# Altium schematic sheet Power.SchDoc
size A
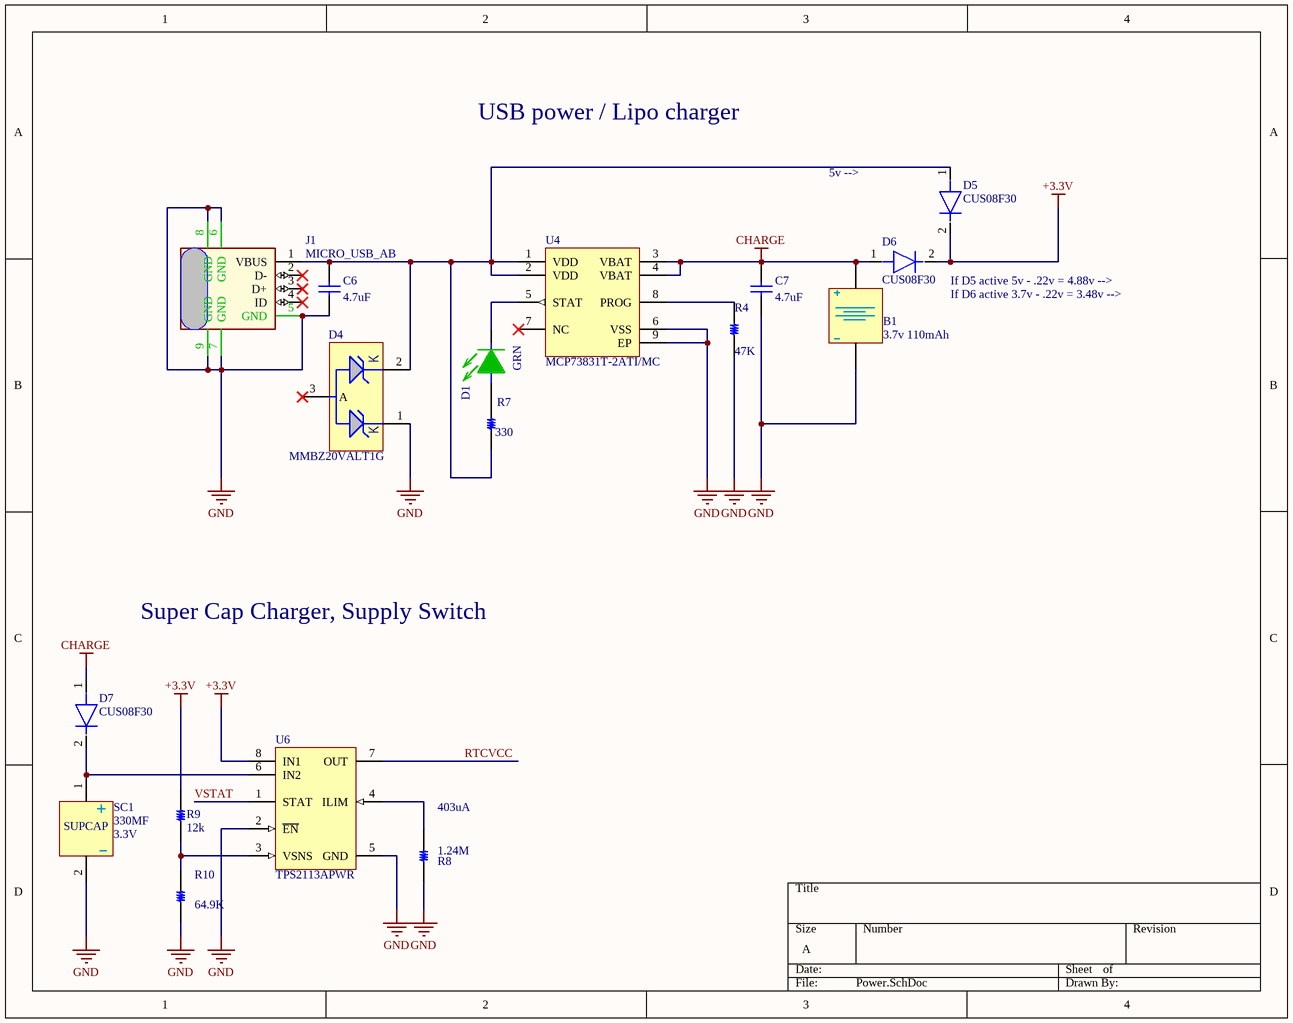
[diagram p0: Power.SchDoc]

## Parts
B1  value 3.7v 110mAh  [LIPO_110mAh]  (hidden comment: LIPO_400mAh_Sparkfun)
C6  value 4.7uF  [C1608L]  (hidden comment: C475-0603-X5R-20%)
C7  value 4.7uF  [C1608L]  (hidden comment: C475-0603-X5R-20%)
D1  value GRN  [LEDCP2015X08L]  (hidden comment: LED-GRN-0805-LUMEX-SML-LXT0805SGW)
D4  Manufacturer Part Number 1: MMBZ20VALT1G  [SOT23_95P237x111-3N]  (hidden comment: TVS_MMBZ20VALT1G_OnSemi)
D5  CUS08F30  [DIODE-USC]
D6  CUS08F30  [DIODE-USC]
D7  CUS08F30  [DIODE-USC]
J1  MICRO_USB_AB  [CONN USB_MIcro]
R4  value 47K  [C1005L]  (hidden comment: R473-0402-5%)
R7  value 330  [C1005L]  (hidden comment: R331-0402-5%)
R8  1.24M  [C1608N]
R9  value 12k  [C1608N]  (hidden comment: R123_0603_5%_Panasonic)
R10  value 64.9K  [C1608L]  (hidden comment: R643R9-0603-1%_Yageo)
SC1  value 330MF  [SUPCAP_330MF]  (hidden comment: SUPCAP_330MF_SMD)
U4  MCP73831T-2ATI/MC  [DFN-MC8]
U6  TPS2113APWR  [PW8_N]

## Nets
+3.3V: D5.2 D6.2 R9.2 U6.8(IN1)
CHARGE: B1.1 C7.2 D6.1 D7.1 U4.3(VBAT) U4.4(VBAT)
GND: B1.2 C6.1 C7.1 D4.1(K) J1.5(GND) J1.6(GND) J1.7(GND) J1.8(GND) J1.9(GND) R4.1 R8.1 R10.1 SC1.2 U4.6(VSS) U4.9(EP) U6.2(~{EN}) U6.5(GND)
RTCVCC: U6.7(OUT)
VSTAT: U6.1(STAT)
NetC6_2: C6.2 D4.2(K) D5.1 J1.1(VBUS) R7.1 U4.1(VDD) U4.2(VDD)
NetD1_1: D1.1 R7.2
NetD1_2: D1.2 U4.5(STAT)
NetD7_2: D7.2 SC1.1 U6.6(IN2)
NetR4_2: R4.2 U4.8(PROG)
NetR8_2: R8.2 U6.4(ILIM)
NetR9_1: R9.1 R10.2 U6.3(VSNS)

Not connected (* = marked no-connect by the designer): D4 3(A)*; J1 2(D-)* 3(D+)* 4(ID)*; U4 7(NC)*

## Notes on the sheet
- USB power / Lipo charger
- 5v -->
- (near D6) If D5 active 5v - .22v = 4.88v -->
- (near D6) If D6 active 3.7v - .22v = 3.48v -->
- Super Cap Charger, Supply Switch
- 3.3V
- (near R8) 403uA
- (in symbol SUPCAP_330MF_SMD) SUPCAP

## Library data of the parts
B1 = LIPO_400mAh_Sparkfun: 400mAh_Lipo_battery; Supplier 1: SparkFun; Supplier Part Number 1: 10718; Price: 6.95
C6 C7 = C475-0603-X5R-20%: CAP CER 4.7UF 6.3V 20% X5R 0603; PART NUMBER: C1608X5R0J475M/0.80; Voltage Rating: 6V3; Temperature Stability: +/-15%; PART DESC: CAP CER 4.7UF 6.3V 20% X5R 0603; Package/Size: 0603; Lead Free: Y; Tolerance: 20%; Operating Temp Range: -55øC to +125øC; Supplier 1: Digi-Key; Supplier Part Number 1: 445-1417-1-ND
D1 = LED-GRN-0805-LUMEX-SML-LXT0805SGW: LED THIN 565NM GRN DIFF 0805 SMD; PART DESC: SMT GREEN LED, 0805; PART NUMBER: SML-LXT0805GW-TR; Manufacturer: Lumex; Cost Volume: 10k; Cost Source: Mouser; Geometry.Height: 0.031; Voltage: 1.8V; Man-phone: 847-359-2790; PCB DECAL: SML-LXT0805SRW-SMT-LED; Cost: $0.093; Cost Date: 06-12-2006; Package/Size: 0805 SMT; Lead Free: Y; Operating Temp Range: -25C - 80C; Man-website: www.lumex.com; Disti-website: www.mouser.com; Digikey: 67-1553-1-ND; Supplier 1: Digi-Key; Supplier Part Number 1: 67-1553-1-ND
D4 = TVS_MMBZ20VALT1G_OnSemi: TVS DIODE 17VWM 28VC SOT23; Manufacturer 1: ON Semiconductor; Supplier 1: Digi-Key; Supplier Part Number 1: MMBZ20VALT1GOSCT-ND
D5-D7 = DIODE-CUS08F30-30v-800MA-USC-Toshiba: DIODE SCHOTTKY 30V 800MA USC; Manufacturer 1: Toshiba Semiconductor and Storage; Manufacturer Part Number 1: CUS08F30,H3F; Supplier 1: Digi-Key; Supplier Part Number 1: CUS08F30H3FCT-ND
J1 = CONN_MICRO_USB_AB: MANUFACTURER: HIROSE; PART NUMBER: ZX62-AB-5P; DIGIKEY: H11635CT-ND; Supplier 1: Digi-Key; Supplier Part Number 1: H11635CT-ND; VALUE: MICRO_USB_AB
R4 = R473-0402-5%: DEPRECATED - RES 47K OHM 1/10W 5% 0402 SMD; PART DESC: Resistor, 0402, 5%; PART NUMBER: CR0402-16W-473JT; Manufacturer: Venkel LTD; Location: Blue Bins; PCB DECAL: 0402; Cost: $0.0014; Supplier 1: Digi-Key; Supplier Part Number 1: P47KJCT-ND
R8 = R4.7M-0603-5%-Yageo: RES SMD 4.7M OHM 5% 1/10W 0603; Manufacturer Part Number 1: RC0603JR-074M7L; Manufacturer 1: Yageo; Supplier 1: Digi-Key; Supplier Part Number 1: 311-4.7MGRCT-ND; VALUE: 1.24M
R9 = R123_0603_5%_Panasonic: RES SMD 12K OHM 5% 1/10W 0603; Manufacturer 1: Panasonic Electronic Components; Manufacturer Part Number 1: ERJ-3GEYJ123V; Supplier 1: Digi-Key; Supplier Part Number 1: P12KGCT-ND
R10 = R643R9-0603-1%_Yageo: RES SMD 64.9 OHM 1% 1/10W 0603; Manufacturer 1: Yageo; Manufacturer Part Number 1: RC0603FR-0764R9L; Supplier 1: Digi-key; Supplier Part Number 1: 311-64.9HRCT-ND
SC1 = SUPCAP_330MF_SMD: CAP 330MF -20% +80% 3.3V SMD; Supplier 1: Digi-Key; Supplier Part Number 1: 604-1160-1-ND
U4 = MCP73831T-2ATI/MC: Miniature Single-Cell, Fully Integrated Li-Ion, Li-Polymer Charge Management Controller, 4.2V, 8-Pin DFN, Industrial Temperature, Tape and Reel; Manufacturer: Microchip; DatasheetVersion: revE, Sep-2008; PackageVersion: revBB, Aug-2009; PackageReference: DFN-MC8; PackageDescription: 8-Lead Plastic Dual Flat, No Lead Package (MC) - 2x3x0.9mm Body [DFN]; Supplier 1: Digi-Key; Supplier Part Number 1: MCP73831T-2ATI/MC-ND; Supplier 2: Mouser; Supplier Part Number 2: 579-MCP73831T-2ATIMC; Mounting Technology: Surface Mount; PartNumber: MCP73831T-2ATI/MC; ComponentLink1Description: Manufacturer URL; ComponentLink1URL: http://www.microchip.com/; ComponentLink2Description: Datasheet; ComponentLink2URL: http://ww1.microchip.com/downloads/en/DeviceDoc/21984e.pdf; ComponentLink3Description: Package Specification; ComponentLink3URL: http://www.microchip.com/stellent/groups/techpub_sg/documents/packagingspec/en012702.pdf
U6 = TPS2113APWR: Dual In / Single Out Autoswitching Power Mux, 2.8 to 5.5 V, -40 to 85 degC, 8-pin TSSOP (PW), Green (RoHS & no Sb/Br); Manufacturer: Texas Instruments; IN1 Output Current(Max)(A): 1.25; IN1 rDS(on)(Typ)(mOhm): 84; IN1, IN2 Input Voltage(Max)(V): 5.5; IN1, IN2 Input Voltage(Min)(V): 2.8; IN2 rDS(on)(Typ)(Ohms): 0.084; Number of Inputs: 2; SubFamily: Power Multiplexer (MUX); DatasheetVersion: SBVS045C; PackageVersion: revG, Feb-2011; PackageReference: PW8; PackageDescription: 8-Pin Plastic Thin Small Outline Package 3 x 4.4 mm Body ,0.65 mm Pitch; Supplier 1: Digi-Key; Supplier Part Number 1: 296-16938-1-ND; Supplier 2: Newark; Supplier Part Number 2: 01J0961; Supplier 3: Mouser; Supplier Part Number 3: 595-TPS2113APWR; Eco-Plan: Green (RoHS & no Sb/Br); IN2 Output Current(Max)(A): 1.25; Mounting Technology: Surface Mount; Code_JEDEC: MO-153; PartNumber: TPS2113APWR; ComponentLink1Description: Datasheet; ComponentLink1URL: http://www.ti.com/general/docs/lit/getliterature.tsp?genericPartNumber=TPS2113A&fileType=pdf
R7 = R331-0402-5%: Supplier 1: Digi-Key; Supplier Part Number 1: P3.30KLCT-ND